# Altium schematic sheet Плата коммутации.SchDoc: {Наименование}
size 420 x 297 mm; ApprovedBy: {Утвердил}; CheckedBy: {Проверил}; DrawnBy: {Разработал}; Engineer: {Инженер}; DocumentNumber: {Обозначение}; SheetNumber: {}; SheetTotal: {}; Scale: {Масш.}; Title1str: {Наименование}; PageSetup: Record=PageOptions|CenterHorizontal=False|CenterVertical=False|PrintScale=0.33|XCorrection=0.00|YCorrection=0.00|PrintKind=1|BorderSize=5000000|LeftOffset=0|BottomOffset=0|Orientation=1|PaperLength=1000|PaperWidth=1000|Scale=100|PaperSource=15|PrintQuality=600|MediaType=1|DitherType=10|PaperKind=A4|PrintScaleMode=1; Title2str: {Наименование}; ProcessInspection: {Т.контр.}; Mass: {Масса}; NormInspection: {Н.контр.}; EngineerName: {Инженер}; Letter1Column: {}; Letter2Column: {}; Letter3Column: {}; DocumentType2str: Схема электрическая принципиальная; Izdelie: {Изделие}; ImagePath: {Перв. применение}; Rule: PcbType=ProtelPcb
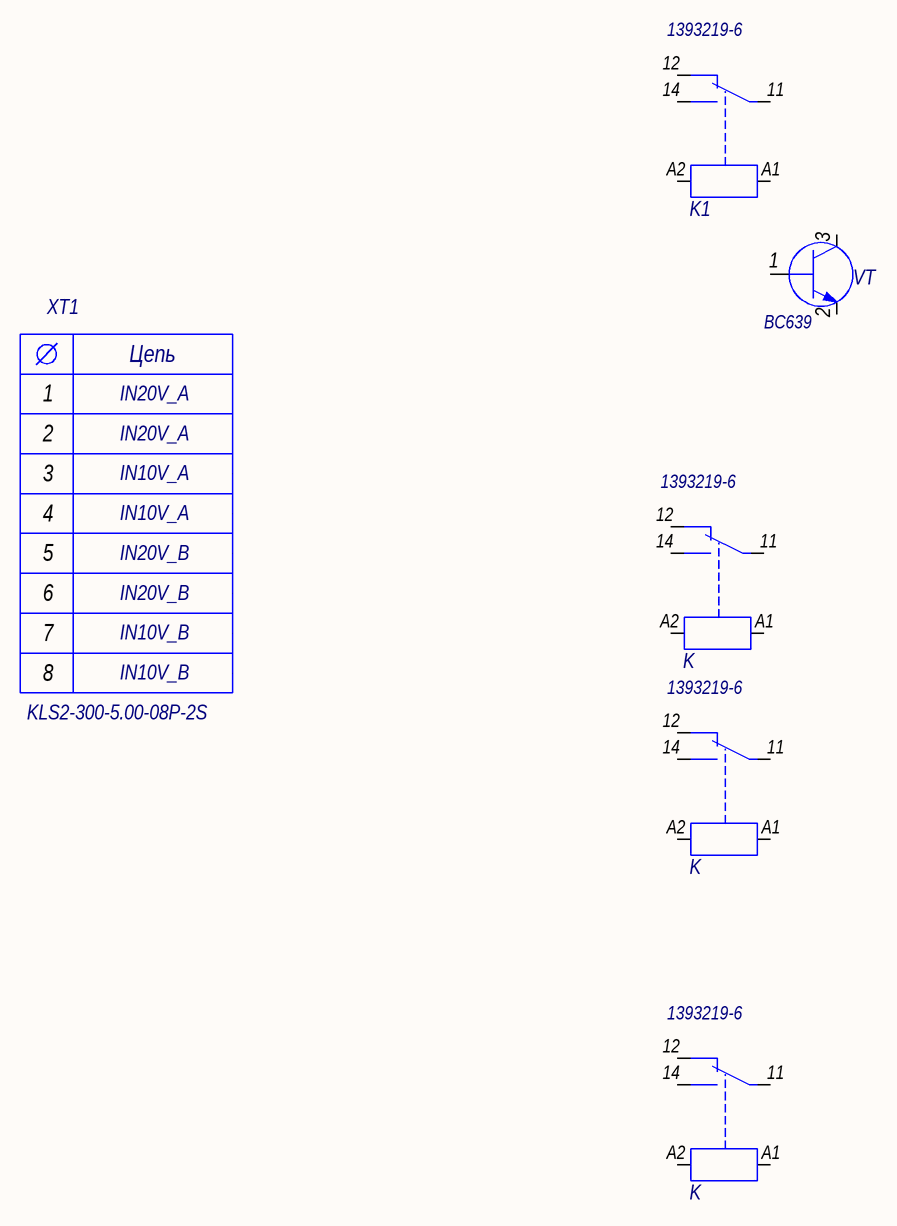
[diagram p0: Плата коммутации.SchDoc]

## Parts
(Parts that share a designator on the sheet are numbered #1, #2 ... from top to bottom, then left to right.)
K1  1393219-6
K#1  1393219-6
K#2  1393219-6
K#3  1393219-6
VT  BC639  [TO-92]
XT1  KLS2-300-5.00-08P-2S

## Nets

Not connected (* = marked no-connect by the designer): K1 11 12 14 A1 A2; K#1 11 12 14 A1 A2; K#2 11 12 14 A1 A2; K#3 11 12 14 A1 A2; VT 1(B) 2(E) 3(K); XT1 1 2 3 4 5 6 7 8

## Notes on the sheet
- (near XT1) IN20V_A
- (near XT1) IN10V_A
- (near XT1) IN20V_B
- (near XT1) IN10V_B
- Перв. примен.
- Справ. №
- Подп. и дата
- Инв. № дубл.
- Взам. инв. №
- Изм.
- Лист
- № докум.
- Подп.
- Дата
- Лит.
- Масса
- Масштаб
- Т.контр.
- Пров.
- Разраб.
- Листов
- Инв. № подл.
- Н.контр.
- Утв.
- Формат  A3
- (in symbol KLS2-300-5.00-08P-2S) Цепь

## Library data of the parts
K1 K#1-K#3 = Power PCB Relay RT1: Реле электромеханическое; Part Number: Power PCB Relay RT1
VT = BC639: Транзистор n-p-n; ValueManufacturer: ф. Fairchild; PE3: Транзистор BC639 (Fairchild); Part Number: BC639; ValueManufacturerPartNumber: BC639; ValueType: Транзистор
XT1 = KLS2-300-5.00-08P-2S: Колодка клеммная 8; ValueManufacturer: ф. KLS; ValueType: Клеммник; PE3: Колодка клеммная KLS2-300-5.00-08P-2S (KLS); Part Number: KLS2-300-5.00-08P-2S; ValueManufacturerPartNumber: KLS2-300-5.00-08P-2S